# EAGLE schematic onCape (EAGLE 8.1.0)
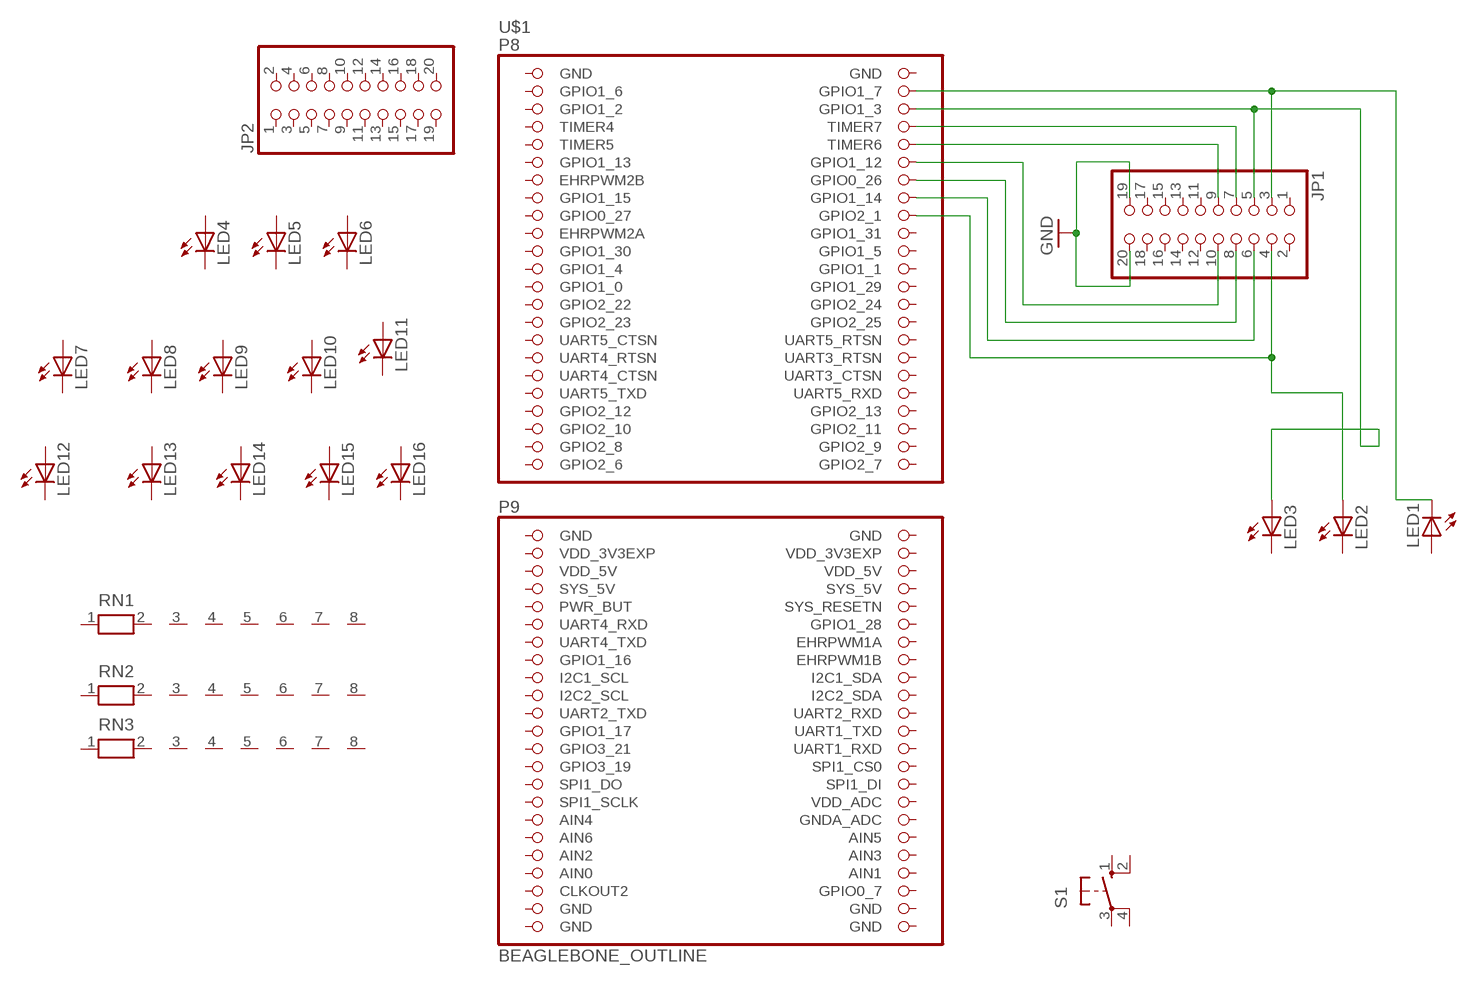
[diagram p0: schematic, sheet 1]

## Parts
JP1  PINHD-2X10  [2X10]
JP2  PINHD-2X10  [2X10]
LED1  LED3MM  [LED3MM]
LED2  LED3MM  [LED3MM]
LED3  LED3MM  [LED3MM]
LED4  LED3MM  [LED3MM]
LED5  LED3MM  [LED3MM]
LED6  LED3MM  [LED3MM]
LED7  LED3MM  [LED3MM]
LED8  LED3MM  [LED3MM]
LED9  LED3MM  [LED3MM]
LED10  LED3MM  [LED3MM]
LED11  LED3MM  [LED3MM]
LED12  LED3MM  [LED3MM]
LED13  LED3MM  [LED3MM]
LED14  LED3MM  [LED3MM]
LED15  LED3MM  [LED3MM]
LED16  LED3MM  [LED3MM]
RN1  RN07  [RN-8]
RN2  RN07  [RN-8]
RN3  RN07  [RN-8]
S1  40-XX-ROUND  [B3F-40XX-ROUND]
U$1  BEAGLEBONE_OUTLINE  [BEAGLEBONE_SHIELD]

## Nets
GND: JP1.19 JP1.20
N$1: JP1.3 LED1.K(C) U$1.4(GPIO1_7)
N$2: JP1.5 LED3.A U$1.6(GPIO1_3)
N$3: JP1.7 U$1.8(TIMER7)
N$4: JP1.9 U$1.10(TIMER6)
N$5: JP1.10 U$1.12(GPIO1_12)
N$6: JP1.8 U$1.14(GPIO0_26)
N$9: JP1.6 U$1.16(GPIO1_14)
N$10: JP1.4 LED2.A U$1.18(GPIO2_1)
Unconnected: JP1.1 JP1.2 JP1.11 JP1.12 JP1.13 JP1.14 JP1.15 JP1.16 JP1.17 JP1.18 JP2.1 JP2.2 JP2.3 JP2.4 JP2.5 JP2.6 JP2.7 JP2.8 JP2.9 JP2.10 JP2.11 JP2.12 JP2.13 JP2.14 JP2.15 JP2.16 JP2.17 JP2.18 JP2.19 JP2.20 LED1.A LED2.K(C) LED3.K(C) LED4.A LED4.K(C) LED5.A LED5.K(C) LED6.A LED6.K(C) LED7.A LED7.K(C) LED8.A LED8.K(C) LED9.A LED9.K(C) LED10.A LED10.K(C) LED11.A LED11.K(C) LED12.A LED12.K(C) LED13.A LED13.K(C) LED14.A LED14.K(C) LED15.A LED15.K(C) LED16.A LED16.K(C) RN1.1 RN1.2 RN1.3 RN1.4 RN1.5 RN1.6 RN1.7 RN1.8 RN2.1 RN2.2 RN2.3 RN2.4 RN2.5 RN2.6 RN2.7 RN2.8 RN3.1 RN3.2 RN3.3 RN3.4 RN3.5 RN3.6 RN3.7 RN3.8 S1.1(S) S1.2(S1) S1.3(P) S1.4(P1) U$1.3(GPIO1_6) U$1.5(GPIO1_2) U$1.7(TIMER4) U$1.9(TIMER5) U$1.11(GPIO1_13) U$1.13(EHRPWM2B) U$1.15(GPIO1_15) U$1.17(GPIO0_27) U$1.19(EHRPWM2A) U$1.20(GPIO1_31) U$1.21(GPIO1_30) U$1.22(GPIO1_5) U$1.23(GPIO1_4) U$1.24(GPIO1_1) U$1.25(GPIO1_0) U$1.26(GPIO1_29) U$1.27(GPIO2_22) U$1.28(GPIO2_24) U$1.29(GPIO2_23) U$1.30(GPIO2_25) U$1.31(UART5_CTSN) U$1.32(UART5_RTSN) U$1.33(UART4_RTSN) U$1.34(UART3_RTSN) U$1.35(UART4_CTSN) U$1.36(UART3_CTSN) U$1.37(UART5_TXD) U$1.38(UART5_RXD) U$1.39(GPIO2_12) U$1.40(GPIO2_13) U$1.41(GPIO2_10) U$1.42(GPIO2_11) U$1.43(GPIO2_8) U$1.44(GPIO2_9) U$1.45(GPIO2_6) U$1.46(GPIO2_7) U$1.54(SYS_5V) U$1.55(PWR_BUT) U$1.56(SYS_RESETN) U$1.57(UART4_RXD) U$1.58(GPIO1_28) U$1.59(UART4_TXD) U$1.60(EHRPWM1A) U$1.61(GPIO1_16) U$1.62(EHRPWM1B) U$1.63(I2C1_SCL) U$1.64(I2C1_SDA) U$1.65(I2C2_SCL) U$1.66(I2C2_SDA) U$1.67(UART2_TXD) U$1.68(UART2_RXD) U$1.69(GPIO1_17) U$1.70(UART1_TXD) U$1.71(GPIO3_21) U$1.72(UART1_RXD) U$1.73(GPIO3_19) U$1.74(SPI1_CS0) U$1.75(SPI1_DO) U$1.76(SPI1_DI) U$1.77(SPI1_SCLK) U$1.78(VDD_ADC) U$1.79(AIN4) U$1.80(GNDA_ADC) U$1.81(AIN6) U$1.82(AIN5) U$1.83(AIN2) U$1.84(AIN3) U$1.86(AIN1) U$1.87(CLKOUT2) U$1.88(GPIO0_7)

## Power pins joined to a net without a drawn wire
AIN0: U$1.85(AIN0)
GND: U$1.1(GND) U$1.2(GND) U$1.47(GND) U$1.48(GND) U$1.89(GND) U$1.90(GND) U$1.91(GND) U$1.92(GND)
SYS_5V: U$1.53(SYS_5V)
VDD_3V3EXP: U$1.49(VDD_3V3EXP) U$1.50(VDD_3V3EXP)
VDD_5V: U$1.51(VDD_5V) U$1.52(VDD_5V)

## Library data of the parts
JP1 JP2 = pinhead:PINHD-2X10: PIN HEADER
LED1-LED16 = adafruit:LED: LED OSRAM: - CHIPLED LG R971, LG N971, LY N971, LG Q971, LY Q971, LO R971, LY R971 LH N974, LH R974 LS Q976, LO Q976, LY Q976 LO Q996 - Hyper CHIPLED LW Q18S LB Q993, LB Q99A, LB R99A - SideLED LS A670, LO A670, LY A670, LG A670, LP A670 LB A673, LV A673, LT A673, LW A673 LH A674 LY A675 LS A676, LA A676, LO A676, LY A676, LW A676 LS A679, LY A679, LG A679 - Hyper Micro SIDELED® LS Y876, LA Y876, LO Y876, LY Y876 LT Y87S - SmartLED LW L88C, LW L88S LB L89C, LB L89S, LG L890 LS L89K, LO L89K, LY L89K LS L896, LA L896, LO L896, LY L896 - TOPLED LS T670, LO T670, LY T670, LG T670, LP T670 LSG T670, LSP T670, LSY T670, LOP T670, LYG T670 LG T671, LOG T671, LSG T671 LB T673, LV T673, LT T673, LW T673 LH T674 LS T676, LA T676, LO T676, LY T676, LB T676, LH T676, LSB T676, LW T676 LB T67C, LV T67C, LT T67C, LS T67K, LO T67K, LY T67K, LW E67C LS E67B, LA E67B, LO E67B, LY E67B, LB E67C, LV E67C, LT E67C LW T67C LS T679, LY T679, LG T679 LS T770, LO T770, LY T770, LG T770, LP T770 LB T773, LV T773, LT T773, LW T773 LH T774 LS E675, LA E675, LY E675, LS T675 LS T776, LA T776, LO T776, LY T776, LB T776 LHGB T686 LT T68C, LB T68C - Hyper Mini TOPLED® LB M676 - Mini TOPLED Santana® LG M470 LS M47K, LO M47K, LY M47K Source: http://www.osram.convergy.de/
RN1-RN3 = resistor-net:RN07: RESISTOR NETWORK; OC_FARNELL: unknown; OC_NEWARK: unknown
S1 = adafruit:40-XX: OMRON SWITCH
U$1 = adafruit:BEAGLEBONE_OUTLINE: Should match A3 pinout - but not completely tested